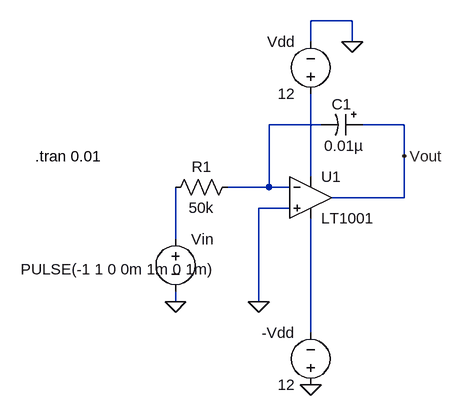
[diagram p0: schematic integrator.asc]
integrator.asc, the LTspice schematic file:
Version 4
SHEET 1 880 680
WIRE 304 -96 240 -96
WIRE 240 -64 240 -96
WIRE 304 -64 304 -96
WIRE 256 64 176 64
WIRE 384 64 320 64
WIRE 384 112 384 64
WIRE 240 144 240 16
WIRE 176 160 176 64
WIRE 176 160 112 160
WIRE 208 160 176 160
WIRE 384 176 384 112
WIRE 384 176 272 176
WIRE 208 192 160 192
WIRE 32 240 32 160
WIRE 32 336 32 320
WIRE 160 336 160 192
WIRE 240 384 240 208
FLAG 32 336 0
FLAG 160 336 0
FLAG 304 -64 0
FLAG 240 464 0
FLAG 384 112 Vout
SYMBOL OpAmps\\LT1001 240 112 R0
SYMATTR InstName U1
SYMBOL res 128 144 R90
WINDOW 0 0 56 VBottom 2
WINDOW 3 32 56 VTop 2
SYMATTR InstName R1
SYMATTR Value 50k
SYMBOL polcap 320 48 R90
WINDOW 0 0 32 VBottom 2
WINDOW 3 33 29 VTop 2
SYMATTR InstName C1
SYMATTR Value 0.01µ
SYMATTR Description Capacitor
SYMATTR Type cap
SYMATTR SpiceLine V=6.3 Irms=0 Rser=4 Lser=0 mfg="AVX" pn="TAJA106M006" type="Tantalum"
SYMBOL voltage 32 224 R0
WINDOW 123 0 0 Left 0
WINDOW 39 0 0 Left 0
WINDOW 3 -238 62 Left 2
SYMATTR Value PULSE(-1 1 0 0m 1m 0 1m)
SYMATTR InstName Vin
SYMBOL voltage 240 32 R180
WINDOW 0 24 96 Left 2
WINDOW 3 24 16 Left 2
SYMATTR InstName Vdd
SYMATTR Value 12
SYMBOL voltage 240 480 R180
WINDOW 0 24 96 Left 2
WINDOW 3 24 16 Left 2
SYMATTR InstName -Vdd
SYMATTR Value 12
TEXT -184 112 Left 2 !.tran 0.01

The netlist it stands for:
* integrator.asc
XU1 0 N001 N002 N004 Vout LT1001  ; pins In+ In- V+ V- OUT
R1 N001 N003 50k
C1 Vout N001 0.01µ V=6.3 Irms=0 Rser=4 Lser=0 mfg="AVX" pn="TAJA106M006" type="Tantalum"
Vin N003 0 PULSE(-1 1 0 0m 1m 0 1m)
Vdd N002 0 12
V§-Vdd 0 N004 12
.tran 0.01
.lib LTC.lib
.backanno
.end